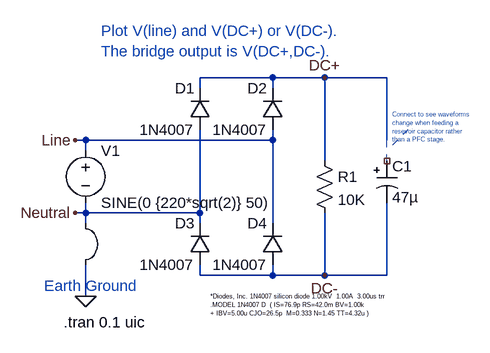
[diagram p0: schematic bridge-rel-gnd_Ian.M.asc]
bridge-rel-gnd_Ian.M.asc, the LTspice schematic file:
Version 4
SHEET 1 1432 680
WIRE 288 32 176 32
WIRE 368 32 288 32
WIRE 464 32 368 32
WIRE 176 48 176 32
WIRE 288 48 288 32
WIRE 0 128 -16 128
WIRE 288 128 288 112
WIRE 288 128 0 128
WIRE 464 128 464 32
WIRE 0 144 0 128
WIRE 368 160 368 32
WIRE 0 240 0 224
WIRE 0 240 -16 240
WIRE 176 240 176 112
WIRE 176 240 0 240
WIRE 0 256 0 240
WIRE 176 256 176 240
WIRE 288 256 288 128
WIRE 176 336 176 320
WIRE 288 336 288 320
WIRE 288 336 176 336
WIRE 368 336 368 240
WIRE 368 336 288 336
WIRE 464 336 464 224
WIRE 464 336 368 336
WIRE 0 368 0 320
FLAG 0 368 0
FLAG -16 128 Line
FLAG -16 240 Neutral
FLAG 368 32 DC+
FLAG 368 336 DC-
SYMBOL diode 192 112 R180
WINDOW 0 24 64 Left 2
WINDOW 3 24 0 Left 2
SYMATTR InstName D1
SYMATTR Value 1N4007
SYMBOL diode 304 112 R180
WINDOW 0 24 64 Left 2
WINDOW 3 24 0 Left 2
SYMATTR InstName D2
SYMATTR Value 1N4007
SYMBOL diode 192 320 R180
WINDOW 0 24 64 Left 2
WINDOW 3 24 0 Left 2
SYMATTR InstName D3
SYMATTR Value 1N4007
SYMBOL diode 304 320 R180
WINDOW 0 24 64 Left 2
WINDOW 3 24 0 Left 2
SYMATTR InstName D4
SYMATTR Value 1N4007
SYMBOL voltage 0 128 R0
WINDOW 123 0 0 Left 0
WINDOW 39 24 124 Left 2
SYMATTR InstName V1
SYMATTR Value SINE(0 {220*sqrt(2)} 50)
SYMBOL Misc\\jumper 64 288 R90
WINDOW 0 -15 26 Invisible 2
SYMATTR InstName X1
SYMATTR Prefix R
SYMATTR Value 1m
SYMBOL res 352 144 R0
SYMATTR InstName R1
SYMATTR Value 10K
SYMBOL polcap 448 160 R0
WINDOW 3 24 56 Left 2
SYMATTR InstName C1
SYMATTR Value 47µ
SYMATTR Description Capacitor
SYMATTR Type cap
SYMATTR SpiceLine V=400 Irms=300m Rser=0.6027 Lser=14.4n mfg="Würth Elektronik" pn="860021380015 WCAP-ATG5 16x25" type="Al electrolytic"
TEXT -34 408 Left 2 !.tran 0.1 uic
TEXT 192 368 Left 0 !*Diodes, Inc. 1N4007 silicon diode 1.00kV  1.00A  3.00us trr   \n.MODEL 1N4007 D  ( IS=76.9p RS=42.0m BV=1.00k\n+ IBV=5.00u CJO=26.5p  M=0.333 N=1.45 TT=4.32u )
TEXT 24 -40 Left 2 ;Plot V(line) and V(DC+) or V(DC-).\nThe bridge output is V(DC+,DC-).
TEXT 472 88 Left 0 ;Connect to see waveforms\nchange when feeding a\nresevoir capacitor rather\nthan a PFC stage.
TEXT -64 352 Left 2 ;Earth Ground
LINE Normal 464 160 464 128 2
LINE Normal 496 112 464 144 2

The netlist it stands for:
* bridge-rel-gnd_Ian.M.asc
D1 0 DC+ 1N4007
D2 Line DC+ 1N4007
D3 DC- 0 1N4007
D4 DC- Line 1N4007
V1 Line 0 SINE(0 {220*sqrt(2)} 50)
R1 DC+ DC- 10K
C1 NC_01 DC- 47µ V=400 Irms=300m Rser=0.6027 Lser=14.4n mfg="Würth Elektronik" pn="860021380015 WCAP-ATG5 16x25" type="Al electrolytic"
.model D D
.lib standard.dio
.tran 0.1 uic
*Diodes, Inc. 1N4007 silicon diode 1.00kV  1.00A  3.00us trr
.MODEL 1N4007 D  ( IS=76.9p RS=42.0m BV=1.00k
+ IBV=5.00u CJO=26.5p  M=0.333 N=1.45 TT=4.32u )
* Plot V(line) and V(DC+) or V(DC-).
* The bridge output is V(DC+,DC-).
* Connect to see waveforms
* change when feeding a
* resevoir capacitor rather
* than a PFC stage.
* Earth Ground
.backanno
.end